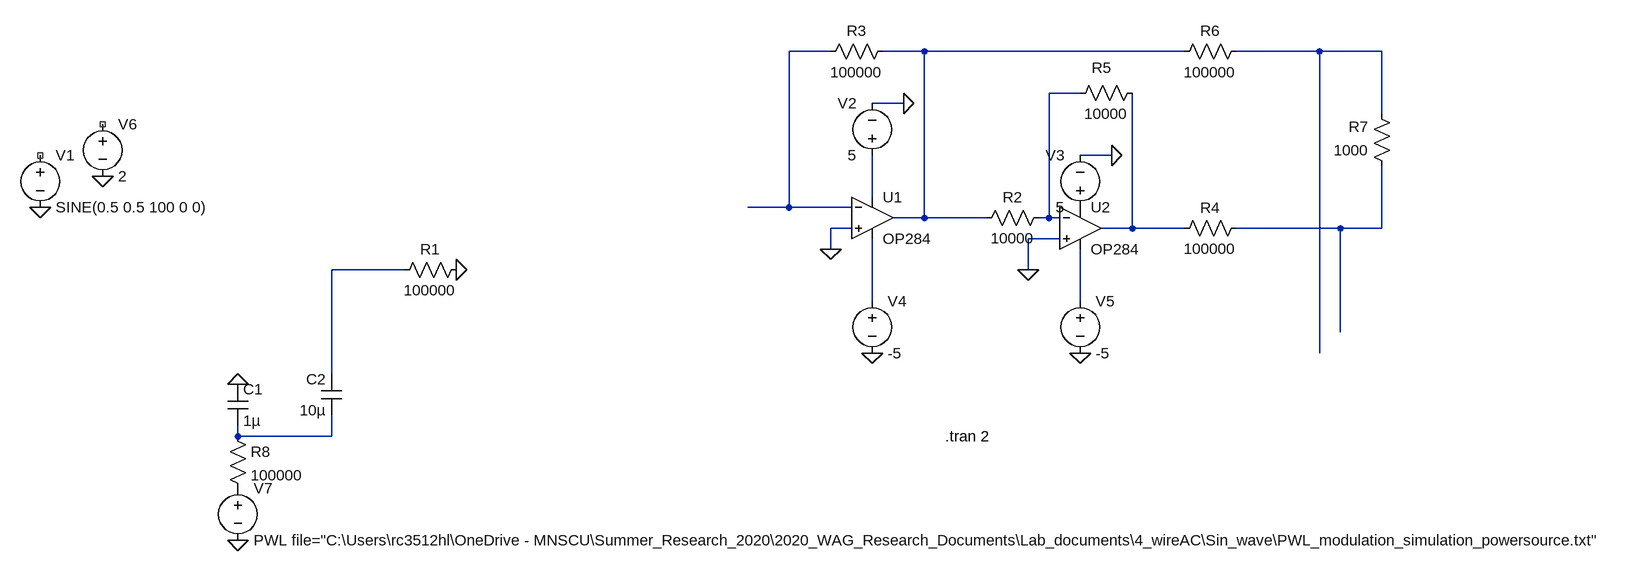
[diagram p0: schematic Subtract_DCoffset_SinewaveMod_9_29_20.asc]
Subtract_DCoffset_SinewaveMod_9_29_20.asc, the LTspice schematic file:
Version 4
SHEET 1 2288 680
WIRE 432 -192 368 -192
WIRE 576 -192 512 -192
WIRE 976 -192 576 -192
WIRE 1184 -192 1056 -192
WIRE 1280 -192 1184 -192
WIRE 816 -128 768 -128
WIRE 544 -112 496 -112
WIRE 1280 -96 1280 -192
WIRE 864 -32 816 -32
WIRE 496 32 496 -32
WIRE 368 48 368 -192
WIRE 368 48 304 48
WIRE 464 48 368 48
WIRE 576 64 576 -192
WIRE 576 64 528 64
WIRE 672 64 576 64
WIRE 768 64 768 -128
WIRE 768 64 752 64
WIRE 784 64 768 64
WIRE 464 80 432 80
WIRE 896 80 896 -128
WIRE 896 80 848 80
WIRE 976 80 896 80
WIRE 1216 80 1056 80
WIRE 1280 80 1280 -16
WIRE 1280 80 1216 80
WIRE 784 96 736 96
WIRE 432 112 432 80
WIRE -224 144 -336 144
WIRE 736 144 736 96
WIRE 496 192 496 96
WIRE 816 192 816 112
WIRE 1216 240 1216 80
WIRE 1184 272 1184 -192
WIRE -336 304 -336 144
WIRE -480 400 -480 384
WIRE -336 400 -336 368
WIRE -336 400 -480 400
FLAG 432 112 0
FLAG 736 144 0
FLAG -784 48 0
FLAG 496 272 0
FLAG 816 272 0
FLAG 864 -32 0
FLAG 544 -112 0
FLAG -688 0 0
FLAG -480 560 0
FLAG -480 320 0
FLAG -144 144 0
SYMBOL voltage -784 -48 R0
WINDOW 123 0 0 Left 0
WINDOW 39 0 0 Left 0
SYMATTR InstName V1
SYMATTR Value SINE(0.5 0.5 100 0 0)
SYMBOL res -128 128 R90
WINDOW 0 0 56 VBottom 2
WINDOW 3 32 56 VTop 2
SYMATTR InstName R1
SYMATTR Value 100000
SYMBOL Opamps\\OP284 496 0 R0
SYMATTR InstName U1
SYMBOL Opamps\\OP284 816 16 R0
SYMATTR InstName U2
SYMBOL res 768 48 R90
WINDOW 0 0 56 VBottom 2
WINDOW 3 32 56 VTop 2
SYMATTR InstName R2
SYMATTR Value 10000
SYMBOL res 528 -208 R90
WINDOW 0 0 56 VBottom 2
WINDOW 3 32 56 VTop 2
SYMATTR InstName R3
SYMATTR Value 100000
SYMBOL res 912 -144 R90
WINDOW 0 -7 63 VBottom 2
WINDOW 3 32 56 VTop 2
SYMATTR InstName R5
SYMATTR Value 10000
SYMBOL voltage 496 -16 R180
WINDOW 0 24 96 Left 2
WINDOW 3 24 16 Left 2
WINDOW 123 0 0 Left 0
WINDOW 39 0 0 Left 0
SYMATTR InstName V2
SYMATTR Value 5
SYMBOL voltage 816 64 R180
WINDOW 0 24 96 Left 2
WINDOW 3 24 16 Left 2
WINDOW 123 0 0 Left 0
WINDOW 39 0 0 Left 0
SYMATTR InstName V3
SYMATTR Value 5
SYMBOL res 1072 -208 R90
WINDOW 0 0 56 VBottom 2
WINDOW 3 32 56 VTop 2
SYMATTR InstName R6
SYMATTR Value 100000
SYMBOL res 1296 0 R180
WINDOW 0 36 76 Left 2
WINDOW 3 36 40 Left 2
SYMATTR InstName R7
SYMATTR Value 1000
SYMBOL res 1072 64 R90
WINDOW 0 0 56 VBottom 2
WINDOW 3 32 56 VTop 2
SYMATTR InstName R4
SYMATTR Value 100000
SYMBOL voltage 496 176 R0
WINDOW 123 0 0 Left 0
WINDOW 39 0 0 Left 0
SYMATTR InstName V4
SYMATTR Value -5
SYMBOL voltage 816 176 R0
WINDOW 123 0 0 Left 0
WINDOW 39 0 0 Left 0
SYMATTR InstName V5
SYMATTR Value -5
SYMBOL voltage -688 -96 R0
WINDOW 123 0 0 Left 0
WINDOW 39 0 0 Left 0
SYMATTR InstName V6
SYMATTR Value 2
SYMBOL voltage -480 464 R0
WINDOW 123 0 0 Left 0
WINDOW 39 0 0 Left 0
SYMATTR InstName V7
SYMATTR Value PWL file="C:\Users\rc3512hl\OneDrive - MNSCU\Summer_Research_2020\2020_WAG_Research_Documents\Lab_documents\4_wireAC\Sin_wave\PWL_modulation_simulation_powersource.txt"
SYMBOL res -496 384 R0
SYMATTR InstName R8
SYMATTR Value 100000
SYMBOL cap -496 320 R0
SYMATTR InstName C1
SYMATTR Value 1µ
SYMBOL cap -320 368 R180
WINDOW 0 24 56 Left 2
WINDOW 3 24 8 Left 2
SYMATTR InstName C2
SYMATTR Value 10µ
TEXT 608 400 Left 2 !.tran 2

The netlist it stands for:
* Subtract_DCoffset_SinewaveMod_9_29_20.asc
V1 NC_01 0 SINE(0.5 0.5 100 0 0)
R1 0 N008 100000
XU1 0 N001 N005 N009 N002 OP284  ; pins In+ In- V+ V- OUT
XU2 0 N004 P001 N010 N006 OP284  ; pins In+ In- V+ V- OUT
R2 N004 N002 10000
R3 N002 N001 100000
R5 N006 N004 10000
V2 N005 0 5
V3 P001 0 5
R6 N003 N002 100000
R7 N007 N003 1000
R4 N007 N006 100000
V4 N009 0 -5
V5 N010 0 -5
V6 NC_02 0 2
V7 P002 0 PWL file="C:\Users\rc3512hl\OneDrive - MNSCU\Summer_Research_2020\2020_WAG_Research_Documents\Lab_documents\4_wireAC\Sin_wave\PWL_modulation_simulation_powersource.txt"
R8 N011 P002 100000
C1 0 N011 1µ
C2 N011 N008 10µ
.tran 2
.lib ADI1.lib
.backanno
.end